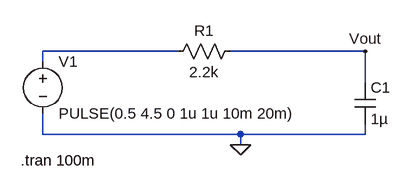
[diagram p0: schematic rc_filt_ltspice.asc]
rc_filt_ltspice.asc, the LTspice schematic file:
Version 4
SHEET 1 880 680
WIRE 80 80 -128 80
WIRE 368 80 160 80
WIRE -128 96 -128 80
WIRE 368 128 368 80
WIRE -128 208 -128 176
WIRE 176 208 -128 208
WIRE 368 208 368 192
WIRE 368 208 176 208
WIRE 176 224 176 208
FLAG 176 224 0
FLAG 368 80 Vout
SYMBOL res 176 64 R90
WINDOW 0 0 56 VBottom 2
WINDOW 3 32 56 VTop 2
SYMATTR InstName R1
SYMATTR Value 2.2k
SYMBOL cap 352 128 R0
SYMATTR InstName C1
SYMATTR Value 1µ
SYMBOL voltage -128 80 R0
WINDOW 123 0 0 Left 0
WINDOW 39 0 0 Left 0
SYMATTR InstName V1
SYMATTR Value PULSE(0.5 4.5 0 1u 1u 10m 20m)
TEXT -162 248 Left 2 !.tran 100m

The netlist it stands for:
* rc_filt_ltspice.asc
R1 Vout N001 2.2k
C1 Vout 0 1µ
V1 N001 0 PULSE(0.5 4.5 0 1u 1u 10m 20m)
.tran 100m
.backanno
.end